# EAGLE design xenium-programmer-rpi (EAGLE 9.6.2)
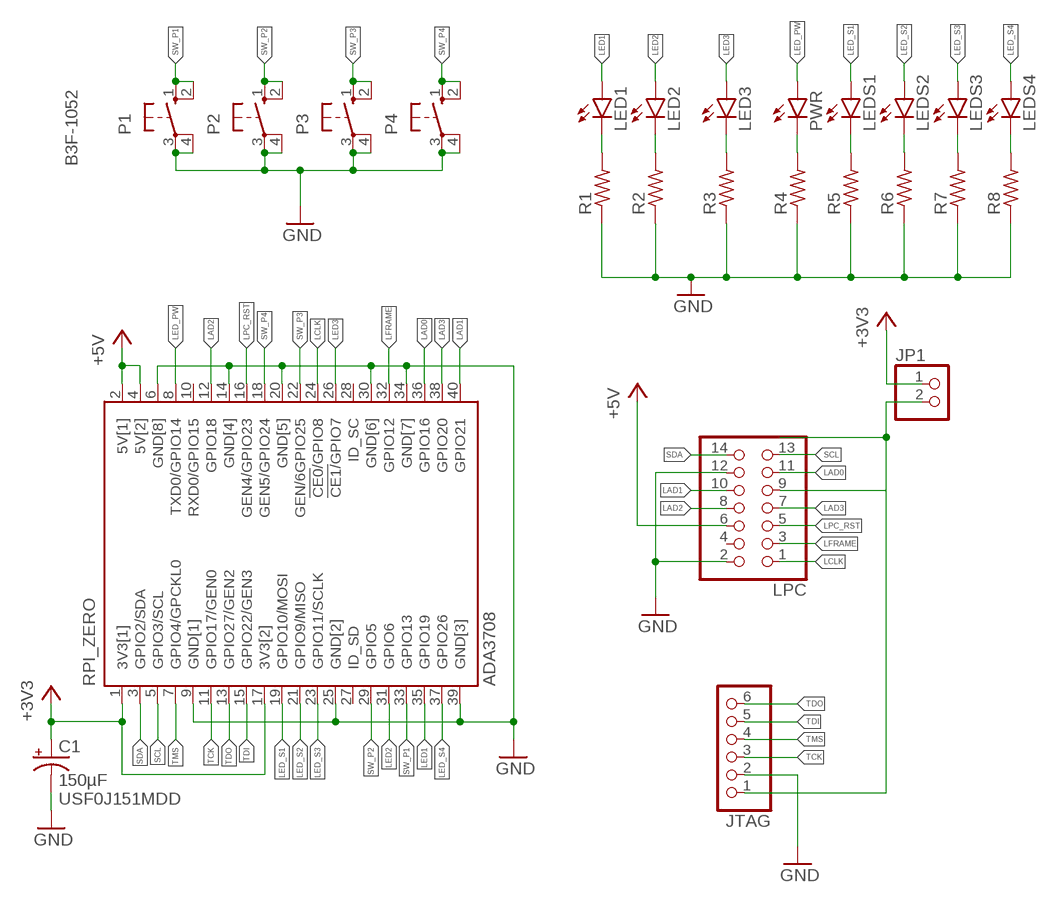
[diagram p0: schematic, sheet 1]

## Parts
C1  150µF  CPOL-USE3.5-8  [E3,5-8]
JP1  PINHD-1X2  [1X02]
JTAG  PINHD-1X6  [1X06]
LED1  LEDCHIPLED_1206  [CHIPLED_1206]
LED2  LEDCHIPLED_1206  [CHIPLED_1206]
LED3  LEDCHIPLED_1206  [CHIPLED_1206]
LEDS1  LEDCHIPLED_1206  [CHIPLED_1206]
LEDS2  LEDCHIPLED_1206  [CHIPLED_1206]
LEDS3  LEDCHIPLED_1206  [CHIPLED_1206]
LEDS4  LEDCHIPLED_1206  [CHIPLED_1206]
LPC  PINHD-2X7  [2X07]
P1  B3F-1052  [B3F-10XX]
P2  B3F-1052  [B3F-10XX]
P3  B3F-1052  [B3F-10XX]
P4  B3F-1052  [B3F-10XX]
PWR  LEDCHIPLED_1206  [CHIPLED_1206]
R1  R-US_R1206  [R1206]
R2  R-US_R1206  [R1206]
R3  R-US_R1206  [R1206]
R4  R-US_R1206  [R1206]
R5  R-US_R1206  [R1206]
R6  R-US_R1206  [R1206]
R7  R-US_R1206  [R1206]
R8  R-US_R1206  [R1206]
RPI_ZERO  ADA3708  [ADA3708_RPI-ZERO]

## Nets
+3V3: C1.+ JP1.1 RPI_ZERO.1(3V3[1]) RPI_ZERO.17(3V3[2])
+5V: LPC.6 RPI_ZERO.2(5V[1]) RPI_ZERO.4(5V[2])
GND: C1.- JTAG.2 LPC.2 LPC.12 P1.3(P) P1.4(P1) P2.3(P) P2.4(P1) P3.3(P) P3.4(P1) P4.3(P) P4.4(P1) R1.1 R2.1 R3.1 R4.1 R5.1 R6.1 R7.1 R8.1 RPI_ZERO.6(GND[8]) RPI_ZERO.9(GND[1]) RPI_ZERO.14(GND[4]) RPI_ZERO.20(GND[5]) RPI_ZERO.25(GND[2]) RPI_ZERO.30(GND[6]) RPI_ZERO.34(GND[7]) RPI_ZERO.39(GND[3])
LAD0: LPC.11 RPI_ZERO.36(GPIO16)
LAD1: LPC.10 RPI_ZERO.40(GPIO21)
LAD2: LPC.8 RPI_ZERO.12(GPIO18)
LAD3: LPC.7 RPI_ZERO.38(GPIO20)
LCLK: LPC.1 RPI_ZERO.24(!CE0!/GPIO8)
LED1: LED1.A RPI_ZERO.35(GPIO19)
LED2: LED2.A RPI_ZERO.31(GPIO6)
LED3: LED3.A RPI_ZERO.26(!CE1/!GPIO7)
LED_PW: PWR.A RPI_ZERO.8(TXD0/GPIO14)
LED_S1: LEDS1.A RPI_ZERO.19(GPIO10/MOSI)
LED_S2: LEDS2.A RPI_ZERO.21(GPIO9/MISO)
LED_S3: LEDS3.A RPI_ZERO.23(GPIO11/SCLK)
LED_S4: LEDS4.A RPI_ZERO.37(GPIO26)
LFRAME: LPC.3 RPI_ZERO.32(GPIO12)
LPC_RST: LPC.5 RPI_ZERO.16(GEN4/GPIO23)
N$1: LED1.C R1.2
N$3: LED2.C R2.2
N$4: LED3.C R3.2
N$5: PWR.C R4.2
N$6: JP1.2 JTAG.1 LPC.9
N$8: LEDS1.C R5.2
N$10: LEDS2.C R6.2
N$12: LEDS3.C R7.2
N$14: LEDS4.C R8.2
SCL: LPC.13 RPI_ZERO.5(GPIO3/SCL)
SDA: LPC.14 RPI_ZERO.3(GPIO2/SDA)
SW_P1: P1.1(S) P1.2(S1) RPI_ZERO.33(GPIO13)
SW_P2: P2.1(S) P2.2(S1) RPI_ZERO.29(GPIO5)
SW_P3: P3.1(S) P3.2(S1) RPI_ZERO.22(GEN/6GPIO25)
SW_P4: P4.1(S) P4.2(S1) RPI_ZERO.18(GEN5/GPIO24)
TCK: JTAG.3 RPI_ZERO.11(GPIO17/GEN0)
TDI: JTAG.5 RPI_ZERO.15(GPIO22/GEN3)
TDO: JTAG.6 RPI_ZERO.13(GPIO27/GEN2)
TMS: JTAG.4 RPI_ZERO.7(GPIO4/GPCKL0)
Unconnected: LPC.4 RPI_ZERO.10(RXD0/GPIO15) RPI_ZERO.27(ID_SD) RPI_ZERO.28(ID_SC)

## Notes on the sheet
- USF0J151MDD

## Library data of the parts
C1 = rcl:CPOL-US: POLARIZED CAPACITOR, American symbol; SPICEPREFIX: C
JP1 = pinhead:PINHD-1X2: PIN HEADER
JTAG = pinhead:PINHD-1X6: PIN HEADER
LED1-LED3 LEDS1-LEDS4 PWR = led:LED: LED OSRAM: - CHIPLED LG R971, LG N971, LY N971, LG Q971, LY Q971, LO R971, LY R971 LH N974, LH R974 LS Q976, LO Q976, LY Q976 LO Q996 - Hyper CHIPLED LW Q18S LB Q993, LB Q99A, LB R99A - SideLED LS A670, LO A670, LY A670, LG A670, LP A670 LB A673, LV A673, LT A673, LW A673 LH A674 LY A675 LS A676, LA A676, LO A676, LY A676, LW A676 LS A679, LY A679, LG A679 - Hyper Micro SIDELED® LS Y876, LA Y876, LO Y876, LY Y876 LT Y87S - SmartLED LW L88C, LW L88S LB L89C, LB L89S, LG L890 LS L89K, LO L89K, LY L89K LS L896, LA L896, LO L896, LY L896 - TOPLED LS T670, LO T670, LY T670, LG T670, LP T670 LSG T670, LSP T670, LSY T670, LOP T670, LYG T670 LG T671, LOG T671, LSG T671 LB T673, LV T673, LT T673, LW T673 LH T674 LS T676, LA T676, LO T676, LY T676, LB T676, LH T676, LSB T676, LW T676 LB T67C, LV T67C, LT T67C, LS T67K, LO T67K, LY T67K, LW E67C LS E67B, LA E67B, LO E67B, LY E67B, LB E67C, LV E67C, LT E67C LW T67C LS T679, LY T679, LG T679 LS T770, LO T770, LY T770, LG T770, LP T770 LB T773, LV T773, LT T773, LW T773 LH T774 LS E675, LA E675, LY E675, LS T675 LS T776, LA T776, LO T776, LY T776, LB T776 LHGB T686 LT T68C, LB T68C - Hyper Mini TOPLED® LB M676 - Mini TOPLED Santana® LG M470 LS M47K, LO M47K, LY M47K Source: http://www.osram.convergy.de LUXEON: - LUMILED® LXK2-PW12-R00, LXK2-PW12-S00, LXK2-PW14-U00, LXK2-PW14-V00 LXK2-PM12-R00, LXK2-PM12-S00, LXK2-PM14-U00 LXK2-PE12-Q00, LXK2-PE12-R00, LXK2-PE12-S00, LXK2-PE14-T00, LXK2-PE14-U00 LXK2-PB12-K00, LXK2-PB12-L00, LXK2-PB12-M00, LXK2-PB14-N00, LXK2-PB14-P00, LXK2-PB14-Q00 LXK2-PR12-L00, LXK2-PR12-M00, LXK2-PR14-Q00, LXK2-PR14-R00 LXK2-PD12-Q00, LXK2-PD12-R00, LXK2-PD12-S00 LXK2-PH12-R00, LXK2-PH12-S00 LXK2-PL12-P00, LXK2-PL12-Q00, LXK2-PL12-R00 Source: www.luxeon.com KINGBRIGHT: KA-3528ASYC Source: www.kingbright.com
LPC = pinhead:PINHD-2X7: PIN HEADER
P1-P4 = B3F-1052:B3F-1052: OMRON SWITCH 1.1mm holes; AVAILABILITY: Unavailable; DESCRIPTION: Tactile Switch; MF: Omron; MP: B3F-1052; PACKAGE: None; PRICE: None
R1-R8 = rcl:R-US_: RESISTOR, American symbol; SPICEPREFIX: R
RPI_ZERO = ADA3708:ADA3708: Raspberry Pi Zero WH (Zero W with Headers); AVAILABILITY: Unavailable; DESCRIPTION: Raspberry Pi Zero WH (Zero W with Headers); MF: Raspberry Pi; MP: ADA3708; PACKAGE: None; PRICE: None

## Board
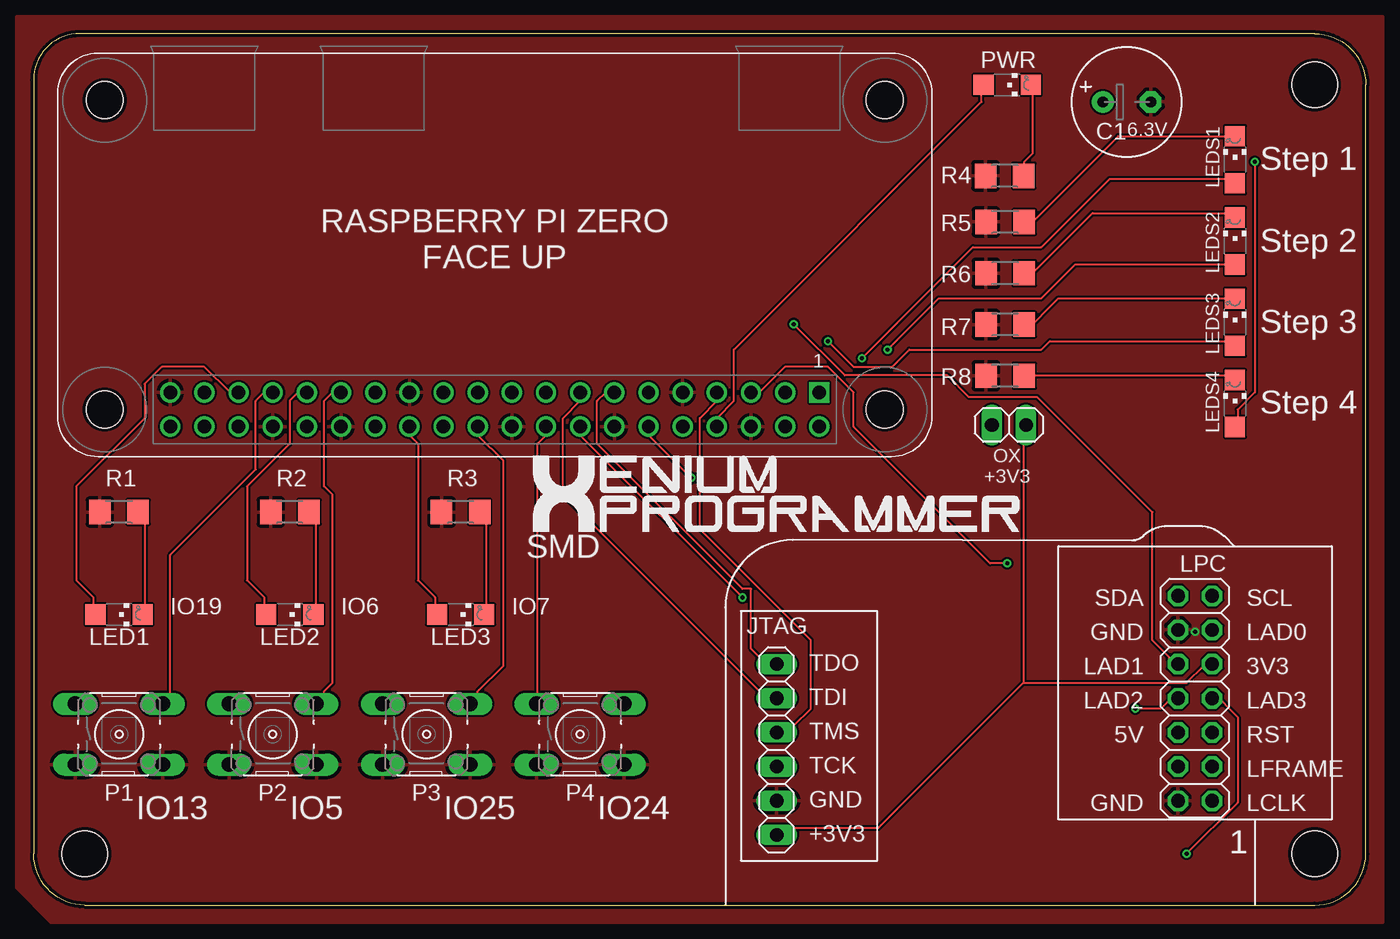
[diagram p1: board, top side]
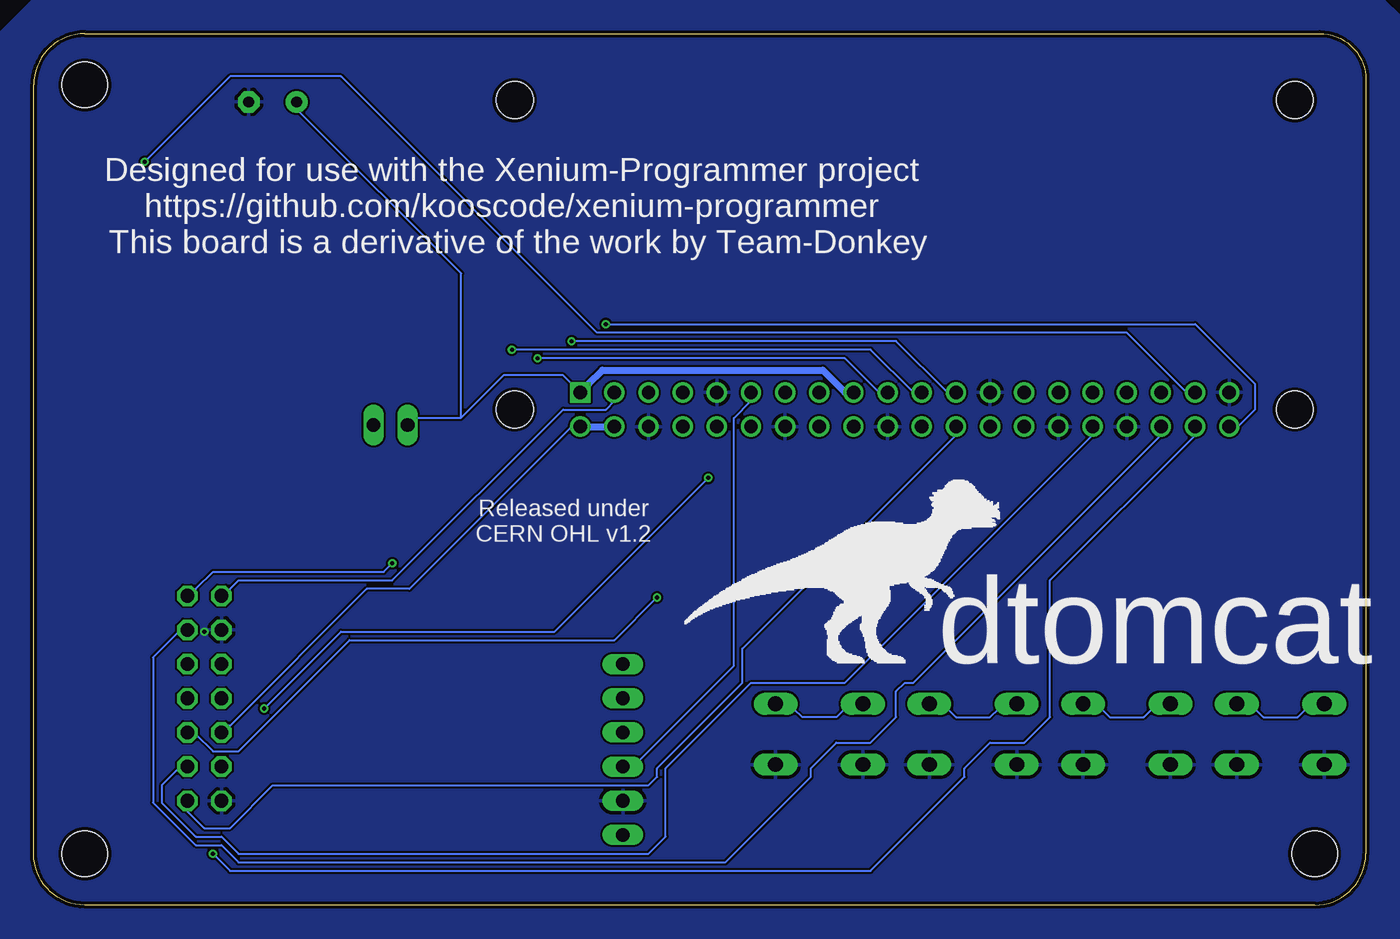
[diagram p2: board, bottom side, seen from below]

Size 99.06 x 64.77 mm. Coordinates in mm from the lower left corner, seen from the top.
Outline: 3.81,0 95.25,0 arc90 99.06,3.81 99.06,60.96 arc90 95.25,64.77 3.43,64.77 arc90 0,61.34 0,3.81 arc90 3.81,0
Copper layers (1*16): Top 0.035mm / dielectric 0.15mm / Bottom 0.035mm
Design rules "default": minimum track width 6mil, minimum drill 12mil, track to track 6mil, track to pad 6mil, pad to pad 6mil, via to via 6mil, smd to smd 0mil, copper to edge 10mil, drill to drill 10mil, minimum pad ring 10mil, minimum via ring 6mil, stop-mask expansion 2mil, vias tented up to drill 100mil, thermal gap 10mil
Holes 3.4 mm at 3.81,3.81 95.25,3.81 95.25,60.96

### Footprints (pad centres in the part's own frame; a part is rotated, then mirrored left to right if it is on the bottom)
E3,5-8 = drill 0.813 pad 1.6: + -1.778,0 | drill 0.813 pad 1.6 octagon: - 1.778,0
1X02 = drill 1.016 long: 1 -1.27,0; 2 1.27,0
1X06 = drill 1.016 long: 1 -6.35,0; 2 -3.81,0; 3 -1.27,0; 4 1.27,0; 5 3.81,0; 6 6.35,0
CHIPLED_1206 = smd 1.5 x 1.5: A 0,-1.75; C 0,1.75
2X07 = drill 1.016 octagon: 1 -7.62,-1.27; 2 -7.62,1.27; 3 -5.08,-1.27; 4 -5.08,1.27; 5 -2.54,-1.27; 6 -2.54,1.27; 7 0,-1.27; 8 0,1.27; 9 2.54,-1.27; 10 2.54,1.27; 11 5.08,-1.27; 12 5.08,1.27; 13 7.62,-1.27; 14 7.62,1.27
B3F-10XX = drill 1.1 long: 1 -3.251,2.261; 2 3.251,2.261; 3 -3.251,-2.261; 4 3.251,-2.261
R1206 = smd 1.6 x 1.803: 1 -1.422,0; 2 1.422,0
ADA3708_RPI-ZERO = drill 1 square: 1 -24.13,-1.27 | drill 1: 2 -24.13,1.27; 3 -21.59,-1.27; 4 -21.59,1.27; 5 -19.05,-1.27; 6 -19.05,1.27; 7 -16.51,-1.27; 8 -16.51,1.27; 9 -13.97,-1.27; 10 -13.97,1.27; 11 -11.43,-1.27; 12 -11.43,1.27; 13 -8.89,-1.27; 14 -8.89,1.27; 15 -6.35,-1.27; 16 -6.35,1.27; 17 -3.81,-1.27; 18 -3.81,1.27; 19 -1.27,-1.27; 20 -1.27,1.27; 21 1.27,-1.27; 22 1.27,1.27; 23 3.81,-1.27; 24 3.81,1.27; 25 6.35,-1.27; 26 6.35,1.27; 27 8.89,-1.27; 28 8.89,1.27; 29 11.43,-1.27; 30 11.43,1.27; 31 13.97,-1.27; 32 13.97,1.27; 33 16.51,-1.27; 34 16.51,1.27; 35 19.05,-1.27; 36 19.05,1.27; 37 21.59,-1.27; 38 21.59,1.27; 39 24.13,-1.27; 40 24.13,1.27 | hole 2.75: -29,-23; -29,0; 29,-23; 29,0

### Placement (x,y rotation side)
C1  81.28,59.69 0 top
JP1  72.52,35.69 0 top
JTAG  55.24,11.56 90 top
LED1  6.35,21.59 270 top
LED2  19.05,21.59 270 top
LED3  31.75,21.59 270 top
LEDS1  89.32,55.4 0 top
LEDS2  89.32,49.36 0 top
LEDS3  89.32,43.32 0 top
LEDS4  89.32,37.28 0 top
LPC  86.36,15.37 90 top
P1  6.35,12.7 0 top
P2  17.78,12.7 0 top
P3  29.21,12.7 0 top
P4  40.64,12.7 0 top
PWR  72.39,60.96 270 top
R1  6.35,29.21 0 top
R2  19.05,29.21 0 top
R3  31.75,29.21 0 top
R4  72.2,54.2 0 top
R5  72.24,50.77 0 top
R6  72.24,46.96 0 top
R7  72.24,43.15 0 top
R8  72.24,39.34 0 top
RPI_ZERO  34.29,36.83 180 top

### Tracks (layer width: path | path; a pad name or v marks a point on that pad's centre or on a via)
+3V3
  Bottom 0.152: 67.27,36.24 64.14,39.37 59.69,39.37 59.05,38.73 57.78,38.73 | 67.27,36.24 67.31,36.2 71.12,36.2 JP1.1 | 67.27,36.24 67.27,46.95 79.38,59.05 79.38,59.69 C1.+
  Bottom 0.508: RPI_ZERO.17 38.73,38.1 40.39,39.75 56.77,39.75 57.78,38.73 RPI_ZERO.1
+5V
  Bottom 0.152: RPI_ZERO.2 59.05,35.56 71.12,23.5 74.3,23.5 84.45,13.34 85.09,13.34 LPC.6
  Bottom 0.508: RPI_ZERO.2 RPI_ZERO.4
GND  (via drill 0.3)
  other vias: 86.36,20.32
  pour Top: -1.27,66.04 100.33,66.04 100.33,-1.27 1.27,-1.27 -1.27,1.27
  pour Bottom: 1.27,69.85 96.52,69.85 101.6,64.77 101.6,-2.54 -5.08,-2.54 -5.08,63.5
LAD0
  Bottom 0.152: RPI_ZERO.36 15.24,34.92 33.66,16.51 34.29,16.51 34.92,15.88 34.92,13.97 36.83,12.06 39.37,12.06 41.27,10.16 41.27,9.53 47.62,3.17 83.82,3.17 85.09,4.45 87,4.45 90.17,7.62 90.17,18.41 88.27,20.32 87.63,20.32 LPC.11
LAD1  (via drill 0.3)
  Top 0.152: v56.52,43.18 60.33,39.37 67.94,39.37 69.55,37.76 74.63,37.76 83.19,29.21 83.19,19.68 84.45,18.41 84.45,17.78 85.09,17.78 LPC.10
  Bottom 0.152: RPI_ZERO.40 9.53,35.56 8.26,36.83 8.26,38.73 12.7,43.18 v56.52,43.18
LAD2  (via drill 0.3)
  Top 0.152: RPI_ZERO.12 45.72,34.92 v48.9,31.75 | v81.92,14.61 83.82,14.61 85.09,15.88 LPC.8
  Bottom 0.152: v48.9,31.75 60.33,20.32 76.2,20.32 v81.92,14.61
LAD3  (via drill 0.3)
  Top 0.152: v85.72,3.81 89.53,7.62 89.53,13.97 87.63,15.88 LPC.7
  Bottom 0.152: RPI_ZERO.38 12.7,34.92 23.5,24.13 23.5,13.97 25.4,12.06 27.94,12.06 29.84,10.16 29.84,9.53 36.83,2.54 84.45,2.54 v85.72,3.81
LCLK
  Bottom 0.152: RPI_ZERO.24 30.48,34.92 46.35,19.05 46.35,16.51 52.7,10.16 52.7,9.53 53.34,8.89 81.28,8.89 84.45,5.71 86.36,5.71 88.27,7.62 87.63,8.26 LPC.1
LED1
  Top 0.152: RPI_ZERO.35 14.61,38.1 12.7,40.01 9.53,40.01 8.26,38.73 8.26,36.2 3.17,31.11 3.17,24.13 4.45,22.86 4.45,21.59 LED1.A
LED2
  Top 0.152: RPI_ZERO.31 19.68,38.1 19.05,37.47 19.05,34.29 15.88,31.11 15.88,24.13 17.14,22.86 17.14,21.59 LED2.A
LED3
  Top 0.152: RPI_ZERO.26 27.94,34.92 28.57,34.29 28.57,24.13 29.84,22.86 29.84,21.59 LED3.A
LED_PW
  Top 0.152: RPI_ZERO.8 50.8,36.2 52.07,37.47 52.07,41.27 70.48,59.69 70.48,60.96 PWR.A
LED_S1  (via drill 0.3)
  Top 0.152: v61.59,40.64 69.85,48.9 74.93,48.9 80.01,53.98 88.9,53.98 LEDS1.A
  Bottom 0.152: v61.59,40.64 38.73,40.64 36.2,38.1 RPI_ZERO.19
LED_S2  (via drill 0.3)
  Top 0.152: v63.5,41.27 67.31,45.09 74.93,45.09 77.47,47.62 88.9,47.62 LEDS2.A
  Bottom 0.152: v63.5,41.27 36.83,41.27 33.66,38.1 RPI_ZERO.21
LED_S3  (via drill 0.3)
  Top 0.152: v59.05,41.91 60.96,40.01 63.84,40.01 65.11,41.27 74.93,41.27 75.56,41.91 88.9,41.91 LEDS3.A
  Bottom 0.152: v59.05,41.91 34.92,41.91 31.11,38.1 RPI_ZERO.23
LED_S4  (via drill 0.3)
  Top 0.152: v90.81,55.24 90.81,38.1 89.53,36.83 89.53,35.56 LEDS4.A
  Bottom 0.152: v90.81,55.24 84.45,61.59 76.2,61.59 57.15,42.55 17.78,42.55 13.34,38.1 RPI_ZERO.37
LFRAME
  Bottom 0.152: RPI_ZERO.32 20.32,34.92 38.73,16.51 45.72,16.51 52.07,10.16 52.07,5.08 53.34,3.81 83.82,3.81 85.09,5.08 87,5.08 89.53,7.62 89.53,8.89 88.27,10.16 87.63,10.16 LPC.3
LPC_RST  (via drill 0.3)
  Top 0.152: RPI_ZERO.16 40.64,34.92 v52.7,22.86
  Bottom 0.152: v52.7,22.86 55.88,19.68 75.56,19.68 83.82,11.43 85.72,11.43 87,12.7 87.63,12.7 LPC.5
N$1
  Top 0.152: LED1.C 8.26,21.59 8.26,29.21 R1.2
N$3
  Top 0.152: LED2.C 20.95,21.59 20.95,29.21 R2.2
N$4
  Top 0.152: LED3.C 33.66,21.59 33.66,29.21 R3.2
N$5
  Top 0.152: PWR.C 74.3,60.96 74.3,55.88 73.66,55.24 73.66,54.61 R4.2
N$6
  Top 0.152: 73.58,16.51 62.78,5.71 55.24,5.71 JTAG.1 | 73.58,16.51 73.58,35.48 JP1.2 | 73.58,16.51 85.72,16.51 87,17.78 87.63,17.78 LPC.9
N$8
  Top 0.152: LEDS1.C 88.9,57.15 80.64,57.15 73.66,50.16 R5.2
N$10
  Top 0.152: LEDS2.C 88.9,51.44 78.74,51.44 73.66,46.35 R6.2
N$12
  Top 0.152: LEDS3.C 88.9,45.09 76.2,45.09 73.66,42.55 R7.2
N$14
  Top 0.152: LEDS4.C 88.9,39.37 73.66,39.37 R8.2
SCL  (via drill 0.3)
  Top 0.152: RPI_ZERO.5 53.98,38.1 55.88,40.01 59.05,40.01 60.96,38.1 60.96,35.56 71.12,25.4 v72.39,25.4
  Bottom 0.152: v72.39,25.4 73.03,24.77 85.72,24.77 87,23.5 87,22.86 87.63,22.86 LPC.13
SDA
  Bottom 0.152: RPI_ZERO.3 55.88,37.47 56.52,36.83 59.69,36.83 72.39,24.13 83.82,24.13 84.45,23.5 84.45,22.86 85.09,22.86 LPC.14
SW_P1
  Top 0.152: RPI_ZERO.33 17.14,38.1 16.51,37.47 16.51,32.38 10.16,26.04 10.16,15.24 P1.2
  Bottom 0.152: P1.1 3.17,14.61 4.45,14.61 5.08,13.97 7.62,13.97 8.26,14.61 9.53,14.61 P1.2
SW_P2
  Top 0.152: RPI_ZERO.29 22.23,38.1 21.59,37.47 21.59,31.11 22.23,30.48 22.23,16.51 21.59,15.88 21.59,15.24 P2.2
  Bottom 0.152: P2.1 14.61,14.61 15.88,14.61 16.51,13.97 19.05,13.97 19.68,14.61 20.95,14.61 P2.2
SW_P3
  Top 0.152: RPI_ZERO.22 33.02,34.92 34.92,33.02 34.92,17.78 33.02,15.88 33.02,15.24 P3.2
  Bottom 0.152: P3.1 26.04,14.61 27.3,14.61 27.94,13.97 30.48,13.97 31.11,14.61 32.38,14.61 P3.2
SW_P4
  Top 0.152: RPI_ZERO.18 38.1,34.92 37.47,34.29 37.47,15.24 P4.1
  Bottom 0.152: P4.2 43.81,14.61 42.55,14.61 41.91,13.97 39.37,13.97 38.73,14.61 37.47,14.61 P4.1
TCK
  Bottom 0.152: RPI_ZERO.11 45.72,37.47 46.99,36.2 46.99,17.78 53.98,10.79 55.24,10.79 JTAG.3
TDI
  Top 0.152: RPI_ZERO.15 40.64,37.47 39.37,36.2 39.37,30.48 53.98,15.88 55.24,15.88 JTAG.5
TDO
  Top 0.152: RPI_ZERO.13 42.55,38.1 41.91,37.47 41.91,34.29 52.7,23.5 53.34,23.5 53.34,19.05 53.98,18.41 55.24,18.41 JTAG.6
TMS
  Top 0.152: RPI_ZERO.7 50.8,37.47 49.53,36.2 49.53,27.94 57.78,19.68 57.78,14.61 56.52,13.34 55.24,13.34 JTAG.4

### Text on the board
tPlace: 6.3V | RASPBERRY PI ZERO / FACE UP | OX / +3V3 | SMD | SDA | SCL | IO19 | IO6 | IO7 | GND | LAD0 | TDO | LAD1 | 3V3 | TDI | LAD2 | LAD3 | TMS | 5V | RST | TCK | LFRAME | GND | GND | LCLK | IO13 | IO5 | IO25 | IO24 | +3V3 | 1
bPlace: Designed for use with the Xenium-Programmer project / https://github.com/kooscode/xenium-programmer | This board is a derivative of the work by Team-Donkey | Released under / CERN OHL v1.2 | dtomcat
tNames: Step 1 | Step 2 | Step 3 | Step 4